# Altium schematic sheet Top.SchDoc
size A4
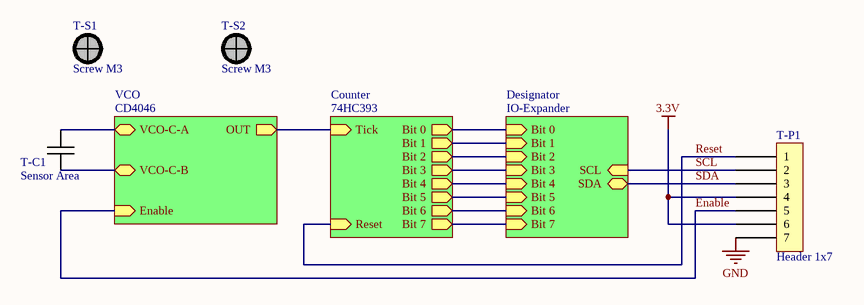
[diagram p0: Top.SchDoc]

## Parts
T-C1  Sensor Area
T-P1  Header 1x7  [Header 1x7]
T-S1  Screw M3  [Screw M3]
T-S2  Screw M3  [Screw M3]

## Sub-sheets
74HC393 = Counter: Tick (in), Reset (in), Bit 0 (out), Bit 1 (out), Bit 2 (out), Bit 3 (out), Bit 4 (out), Bit 5 (out), Bit 6 (out), Bit 7 (out)
CD4046 = VCO: VCO-C-A (bidir), VCO-C-B (bidir), OUT (out), Enable (in)
Designator = IO-Expander: Bit 0 (in), Bit 1 (in), Bit 2 (in), Bit 3 (in), Bit 4 (in), Bit 5 (in), Bit 6 (in), Bit 7 (in), SCL (in), SDA (bidir)

## Nets
3.3V: T-P1.4 T-P1.6
GND: T-P1.7
Enable: T-P1.5 ; sheet CD4046/Enable
Reset: T-P1.1 ; sheet 74HC393/Reset
SCL: T-P1.2 ; sheet Designator/SCL
SDA: T-P1.3 ; sheet Designator/SDA
NetT-C1_1: T-C1.1 ; sheet CD4046/VCO-C-A
NetT-C1_2: T-C1.2 ; sheet CD4046/VCO-C-B
(unnamed): sheet CD4046/OUT, sheet 74HC393/Tick
(unnamed): sheet 74HC393/Bit 0, sheet Designator/Bit 0
(unnamed): sheet 74HC393/Bit 1, sheet Designator/Bit 1
(unnamed): sheet 74HC393/Bit 2, sheet Designator/Bit 2
(unnamed): sheet 74HC393/Bit 3, sheet Designator/Bit 3
(unnamed): sheet 74HC393/Bit 4, sheet Designator/Bit 4
(unnamed): sheet 74HC393/Bit 5, sheet Designator/Bit 5
(unnamed): sheet 74HC393/Bit 6, sheet Designator/Bit 6
(unnamed): sheet 74HC393/Bit 7, sheet Designator/Bit 7

## Library data of the parts
T-C1 = Capacitor